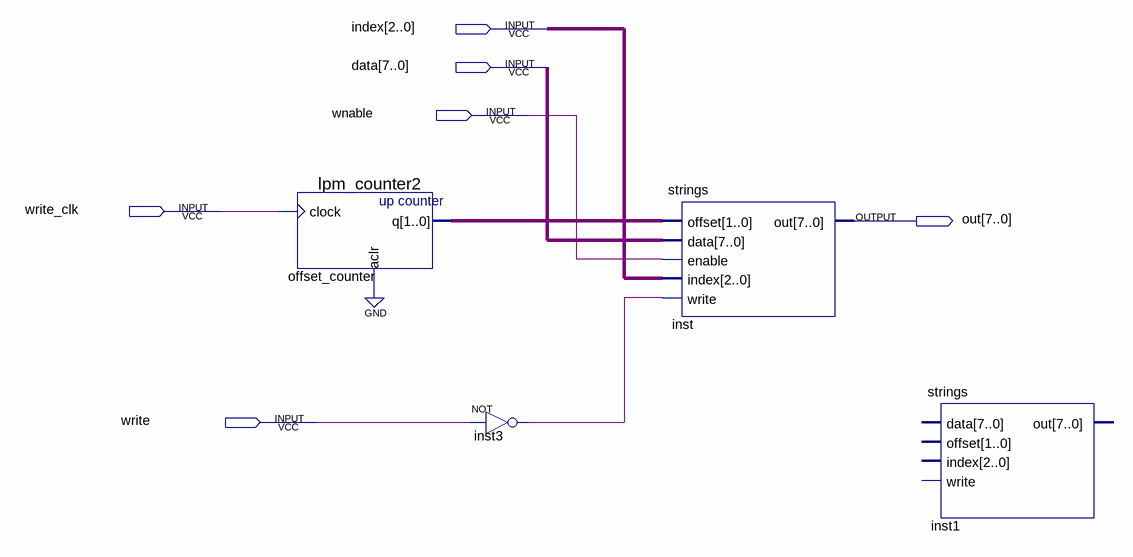
[diagram p0: schematic sheet]
// Quartus schematic test.bdf as structural Verilog: 4 symbols, 6 pins
module test (
  input  [2:0] index,
  input  [7:0] data,
  input  wnable,
  input  write_clk,
  input  write,
  output [7:0] out
);

  wire inst3_out;
  wire [1:0] offset_counter_q;

  lpm_counter2 offset_counter (.clock(write_clk), .aclr(1'b0), .q(offset_counter_q));
  not inst3 (inst3_out, write);
  strings inst (.offset(offset_counter_q), .data(data), .enable(wnable), .index(index), .write(inst3_out), .out(out));
  strings inst1 ();  // open: data, offset, index, write, out
endmodule
